# Altium schematic sheet perifericos.SchDoc: Periféricos do Controlador
size A4; Author: Matheus Gois Vieira; Address1: UnB; Address2: Faculdade do Gama
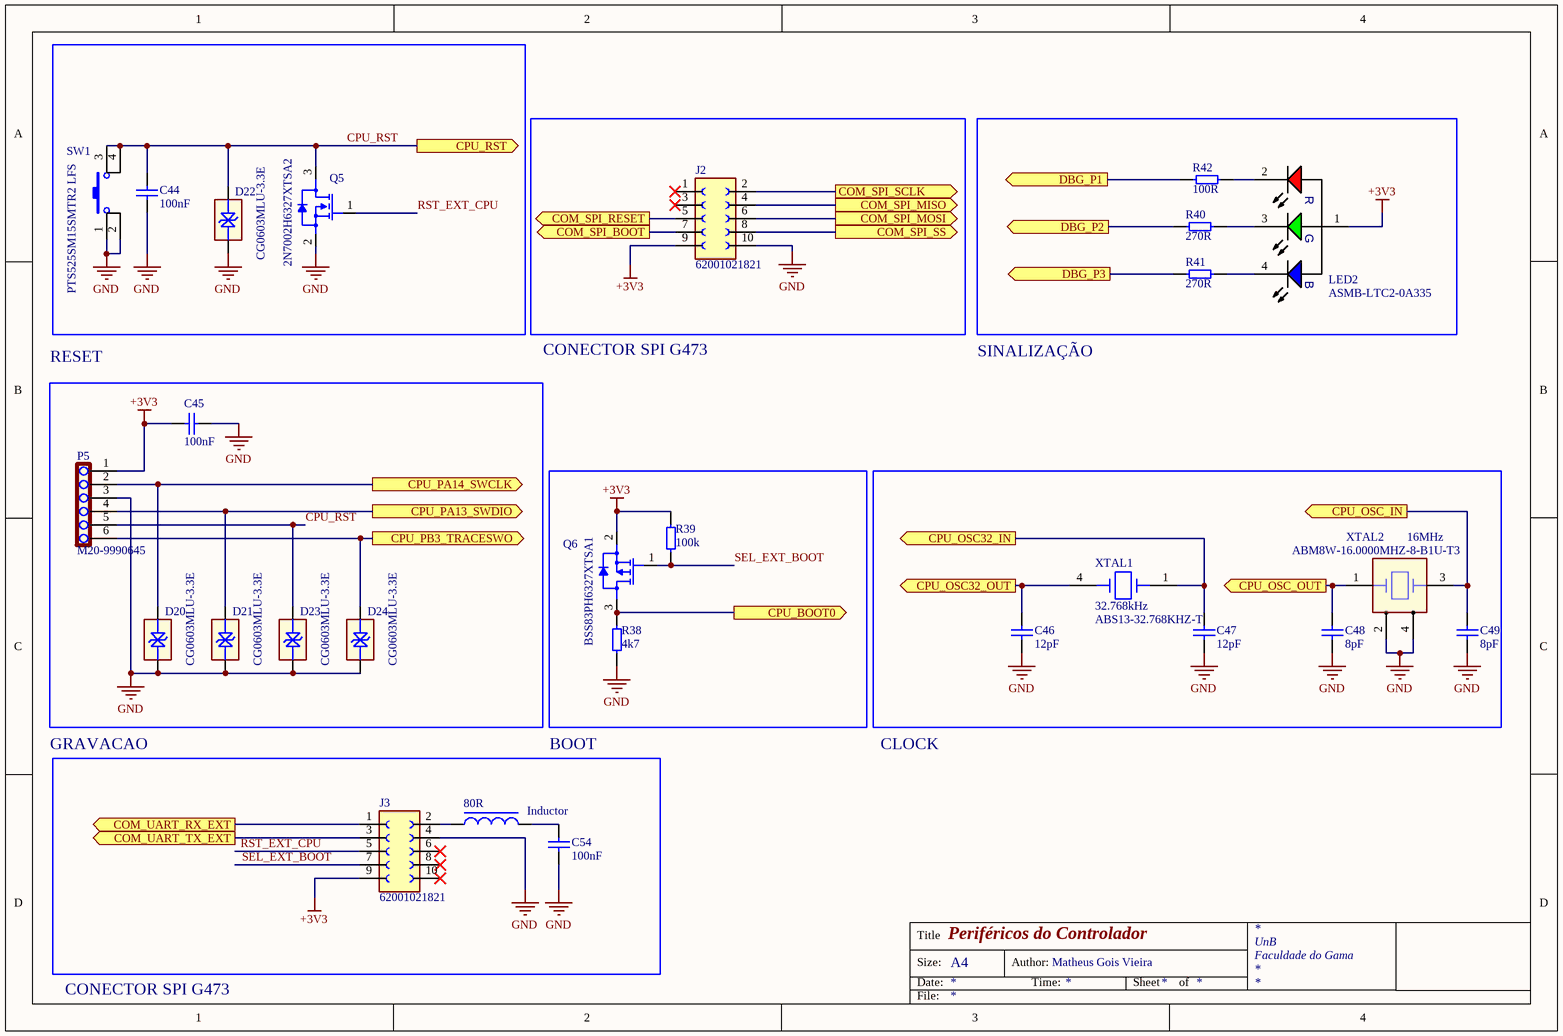
[diagram p0: perifericos.SchDoc]

## Parts
80R  Inductor  [R1608[0603]]
C44  100nF  [0603]
C45  100nF  [0603]
C46  12pF  [0603]
C47  12pF  [0603]
C48  8pF  [0603]
C49  8pF  [0603]
C54  100nF  [0603]
D20  CG0603MLU-3.3E  [DIODE-0603]
D21  CG0603MLU-3.3E  [DIODE-0603]
D22  CG0603MLU-3.3E  [DIODE-0603]
D23  CG0603MLU-3.3E  [DIODE-0603]
D24  CG0603MLU-3.3E  [DIODE-0603]
J2  62001021821  [62001021821]
J3  62001021821  [62001021821]
LED2  ASMB-LTC2-0A335  [ASMB-LTC2-0A335]
P5  M20-9990645  [HDR1X6-2.54MM]
Q5  2N7002H6327XTSA2  [CI-SOT-23]
Q6  BSS83PH6327XTSA1  [CI-SOT-23]
R38  4k7  [0603]
R39  100k  [0603]
R40  270R  [0603]
R41  270R  [0603]
R42  100R  [0603]
SW1  value PTS525SM15SMTR2 LFS  [SWTCH]  (hidden comment: Tact Switch)
XTAL1  32.768kHz  MPN: ABS13-32.768KHZ-T  [XTAL4P_ABS13]
XTAL2  16MHz  MPN: ABM8W-16.0000MHZ-8-B1U-T3  [XTAL4P]

## Blocks framed on the sheet
RESET: C45 D20 D21 D23 D24 P5

## Ports
COM_SPI_BOOT (out), COM_SPI_MISO (out), COM_SPI_MOSI (out), COM_SPI_RESET (out), COM_SPI_SCLK (out), COM_SPI_SS (out), COM_UART_RX_EXT (out), COM_UART_TX_EXT (out), CPU_BOOT0 (out), CPU_OSC32_IN (out), CPU_OSC32_OUT (out), CPU_OSC_IN (out), CPU_OSC_OUT (out), CPU_PA13_SWDIO (out), CPU_PA14_SWCLK (out), CPU_PB3_TRACESWO (out), CPU_RST (out), DBG_P1 (out), DBG_P2 (out), DBG_P3 (out)

## Nets
+3V3: C45.1 J2.9 J3.9 LED2.1(A) P5.1 Q6.2(S) R39.2
GND: C44.2 C45.2 C46.1 C47.1 C48.1 C49.1 C54.2 D20.1 D21.1 D22.1 D23.1 D24.1 J2.10 J3.4 P5.3 Q5.2(S) R38.1 SW1.1 SW1.2 XTAL2.2(GND) XTAL2.4(GND)
COM_SPI_BOOT: J2.7 ; port COM_SPI_BOOT
COM_SPI_MISO: J2.4 ; port COM_SPI_MISO
COM_SPI_MOSI: J2.6 ; port COM_SPI_MOSI
COM_SPI_RESET: J2.5 ; port COM_SPI_RESET
COM_SPI_SCLK: J2.2 ; port COM_SPI_SCLK
COM_SPI_SS: J2.8 ; port COM_SPI_SS
COM_UART_RX_EXT: J3.1 ; port COM_UART_RX_EXT
COM_UART_TX_EXT: J3.3 ; port COM_UART_TX_EXT
CPU_BOOT0: Q6.3(D) R38.2 ; port CPU_BOOT0
CPU_OSC32_IN: C47.2 XTAL1.1 ; port CPU_OSC32_IN
CPU_OSC32_OUT: C46.2 XTAL1.4 ; port CPU_OSC32_OUT
CPU_OSC_IN: C49.2 XTAL2.3 ; port CPU_OSC_IN
CPU_OSC_OUT: C48.2 XTAL2.1 ; port CPU_OSC_OUT
CPU_PA13_SWDIO: D21.2 P5.4 ; port CPU_PA13_SWDIO
CPU_PA14_SWCLK: D20.2 P5.2 ; port CPU_PA14_SWCLK
CPU_PB3_TRACESWO: D24.2 P5.6 ; port CPU_PB3_TRACESWO
CPU_RST: C44.1 D22.2 D23.2 P5.5 Q5.3(D) SW1.3 SW1.4 ; port CPU_RST
DBG_P1: R42.1 ; port DBG_P1
DBG_P2: R40.1 ; port DBG_P2
DBG_P3: R41.1 ; port DBG_P3
RST_EXT_CPU: J3.5 Q5.1(G)
SEL_EXT_BOOT: J3.7 Q6.1(G) R39.1
Net80R_1: 80R.1 J3.2
Net80R_2: 80R.2 C54.1
NetLED2_2: LED2.2(R) R42.2
NetLED2_3: LED2.3(G) R40.2
NetLED2_4: LED2.4(B) R41.2

Not connected (* = marked no-connect by the designer): J2 1* 3(2)*; J3 6(8)* 8(7)* 10(6)*

## Notes on the sheet
- CONECTOR SPI G473
- SINALIZAÇÃO
- GRAVACAO
- BOOT
- CLOCK
- Title
- Size:
- Date:
- A4
- Author:
- Time:
- Sheet
- of
- File:

## Library data of the parts
80R = L: Manufacturer: *; PartNumber: *; Package Type: *; Value: *
C44 C45 C54 = CAP CER SMD-0603 100nF - 50V: Capacitor Ceramic 100nF 20% 50V 0603 (1608 Metric) X7R; MPN: C0603C104M5RACTU; Manufacturer: KEMET; CDI: 018177; Op_Temperature: -55 C to +125 C; Type: Capacitor Ceramic; Value: 100nF; Tolerance: 20%; Package: Tape & Reel; RoHS: SIM; Voltage: 50V; Case: 0603 (1608 Metric); Temp_Coefficient: X7R; NCM: *; CDI_Alternate: *; MPN_Alternate: *; Manufacturer_Alternate: *; Price (und.): 0,10000; Price (10k): 0.00741
C46 C47 = CAP CER SMD-0603 12pF - 50V: Capacitor Ceramic 12pF 10% 50V 0603 (1608 Metric) C0G (NP0); MPN: 06035A120KAT2A; Manufacturer: AVX; CDI: 020618; Op_Temperature: -55 C to +125 C; Type: Capacitor Ceramic; Value: 12pF; Voltage: 50V; Tolerance: 10%; Package: Tape & Reel; Case: 0603 (1608 Metric); Temp_Coefficient: C0G (NP0); RoHS: SIM; NCM: *; CDI_Alternate: *; MPN_Alternate: *; Manufacturer_Alternate: *; Price (und.): 0.22; Price (10k): 0.039
C48 C49 = CAP CER SMD-0603 8pF - 50V: Capacitor Ceramic 8pF 50V 0603 (1608 Metric) C0G (NP0); MPN: CC0603DRNPO9BN8R0; Manufacturer: Yageo; CDI: 020657; Tolerance: 0.5pF; Op_Temperature: -55 C to +125 C; Type: Capacitor Ceramic; Value: 8pF; Package: Tape & Reel; RoHS: SIM; Voltage: 50V; Case: 0603 (1608 Metric); Temp_Coefficient: C0G (NP0); NCM: *; CDI_Alternate: *; MPN_Alternate: *; Manufacturer_Alternate: *; Price (und.): 0,10000; Price (10k): 0.01346
D20-D24 = DIODE SMD CG0603MLU-3.3E: TVS DIODE 3.3V 25V 0603 (1608 metric); Manufacturer: Bourns; Type: Diode TVS; Op_Temperature: -40 C to +125 C; CDI: 014983; Value: CG0603MLU-3.3E; Package: Tape & Reel; MPN: CG0603MLU-3.3E; RoHS: SIM; Price (und.): 0,44; Voltage: 3.3V; Case: 0603 (1608 metric); Price (10k): 0.112
J2 J3 = 62001021821: Female header Temperature range: -40 ... +125 Â°C Colour: Black Connector Design: Double Row / Straight Connector Termination: THT Contact material: Gold-Plated Copper Gender of contacts: Female Housing Material: Polybutylene Terephthalate (PBT) Pitch: 2 mm Series: WR-PHD Poles: 10 Rated current: 2 A Rated voltage: 250 VAC; MF: WÃ¼rth Elektronik; SnapEDA_Link: https://www.snapeda.com/parts/62001021821/Wurth+Elektronik/view-part/?ref=snap; Availability: In Stock; Package: None; Check_prices: https://www.snapeda.com/parts/62001021821/Wurth+Elektronik/view-part/?ref=eda; Price: None; MP: 62001021821; Purchase-URL: https://pricing.snapeda.com/search/part/62001021821/?ref=eda; Value: *
LED2 = LED2 SMD-2121 PLCC4 RGB AComum: LED SMD-2121 PLCC4 RGB - 70mcd Red (2V), 300mcd Green (2.7V), 50mcd Blue (2.7V); Manufacturer: Broadcom Limited; Type: LED SMD; Millicandela_Rating: 70mcd Red, 300mcd Green, 50mcd Blue; Voltage_Forward_Vf_Typ: Red (2V), Green (2.7V), Blue (2.7V); Wavelength_Dominant: 621nm Red, 525nm Green, 468nm Blue; Current_Test: 5mA; Complement_Value: Angle 105°; PCB_INFO: Assembly; Extra_Info: -40 C to +85 C; Engineering_Change_Status_Code: Pending; Revisao: A; CDI: 020457; Component Type: Standard; Value: ASMB-LTC2-0A335; Color: RGB; Package: PLCC4; Size_Dimension: 2.10mm L x 2.10mm W; MPN: ASMB-LTC2-0A335; Model_File: LED; RoHS: SIM; Case: 4-SMD, J-Lead; Price (10k): 0.16500; Price (und.): 0,58000
P5 = HEADER 1x6 PTH: Header, 6-Pin, 2.54mm, PCB; Manufacturer: HARWIN; Op_Temperature: -40°C ~ 105°C; CDI: 020492; Type: Header; Value: M20-9990645; Package: Bulk; MPN: M20-9990645; RoHS: SIM; Price (10k): 0.11029; Price (und.): 0.29000; Case: PTH 1mm 2X2 2.54MM
Q5 = MOSFET N-CHANNEL 2N7002: MOSFET N-CH 60V 300mA SOT23-3; Manufacturer: Infineon; Op_Temperature: -55°C ~ 150°C; CDI: 020458; Type: MOSFET; Value: 2N7002H6327XTSA2; Current_Id: 300mA; Package: Tape & Reel; MPN: 2N7002H6327XTSA2; RoHS: SIM; Case: SOT-23-3; Current: 300mA; Price (10k): 0.04370; Price (und.): 0,29000
Q6 = MOSFET P-CHANNEL BSS83P: MOSFET P-CH 60V 330mA SOT23-3; Manufacturer: Infineon; Op_Temperature: -55°C ~ 150°C; CDI: 020459; Type: MOSFET; Value: BSS83PH6327XTSA1; Current_Id: 330mA; Package: Tape & Reel; MPN: BSS83PH6327XTSA1; RoHS: SIM; Case: SOT-23-3; Current: 330mA; Price (10k): 0.10362; Price (und.): 0,49000
R38 = RES SMD-0603 4k7 0.5% 1/16W: Resistor Thick Film 4k7 0.5% 0.063W, 1/16W 0603 (1608 metric) +/- 25 PPM / K; MPN: RR0816P-472-D; Manufacturer: Susumu; CDI: 019051; Op_Temperature: -55 C to +125 C; Type: Resistor Thick Film; Value: 4k7; Package: Tape & Reel; RoHS: SIM; Tolerance: 0.5%; Power (Watts): 1/16W; Case: 0603; Price (10k): 0.00993; Price (und.): 0,10000
R39 = RES SMD-0603 100k 1% 1/10W: Resistor Thick Film 100k 1% 0.1W, 1/10W 0603 (1608 metric) +/- 100 PPM / K; MPN: CRCW0603100KFKEA; Manufacturer: Vishay; MPN_Alternate: ERJ-3EKF1003V; CDI: 017438; Op_Temperature: -55 C to +155 C; Type: Resistor Thick Film; Value: 100k; Tolerance: 1%; Package: Tape & Reel; RoHS: SIM; Power (Watts): 1/10W; Case: 0603; Price (10k): 0.00468; Price (und.): 0,10000
R40 R41 = RES SMD-0603 270R 1% 1/10W: Resistor Thick Film 270 Ohms ±1% 0.1W, 1/10W Chip Resistor 0603 (1608 Metric) Automotive AEC-Q200 Thick Film; MPN: RMCF0603FT270R; Manufacturer: Stackpole Electronics Inc; CDI: 013719; Op_Temperature: -55 C to +155 C; Type: Resistor Thick Film; Value: 270R; Tolerance: ±1%; Package: Tape & Reel; RoHS: SIM; Power (Watts): 1/10W; Voltage: *; Case: 0603; NCM: *; CDI_Alternate: *; MPN_Alternate: *; Manufacturer_Alternate: *; Price (und.): 0,10000; Price (10k): 0.00218
R42 = RES SMD-0603 100R 1% 1/10W: Resistor Thick Film 100R 1% 0.1W, 1/10W 0603 (1608 metric) +/- 100 PPM / K; MPN: RC0603FR-07100RL; Manufacturer: Yageo; CDI: 020463; Op_Temperature: -55 C to +155 C; Type: Resistor Thick Film; Value: 100R; Tolerance: 1%; Package: Tape & Reel; RoHS: SIM; Power (Watts): 1/10W; Case: 0603; Price (10k): 0.002; Price (und.): 0.10
SW1 = Tact Switch: Chave pushbuttom NA polo simples SMD; Manufacturer: C&K; CDI: 014225; Op_Temperature: -20°C ~ 70°C; MPN: PTS525SM15SMTR2 LFS; Case: 5.25x5.25mm; Package: Tape & Reel; Price (10k): 0.16066; Price (und.): 0,29000; RoHS: SIM; Type: Switches
XTAL1 = XTAL-ABS13-32.768kHz: Crystal 32.768kHz 20PPM SMD; Manufacturer: Abracon; Clamper_PN: XTAL0010; Op_Temperature: -40°C ~ 85°C; CDI: 020477; Case: 2-SMD; Value: 32.768kHz; Tolerance: 20PPM; Package: Tape & Reel; Price (10k): 0.45; Price (und.): 0.79; RoHS: SIM; Type: Crystals
XTAL2 = XTAL-ABM8W-16MHz: Crystal 16MHz 10PPM SMD; Manufacturer: Abracon; Clamper_PN: XTAL0010; Op_Temperature: -20°C ~ 70°C; CDI: 020479; Case: 4-SMD; Value: 16MHz; Tolerance: 10PPM; Package: Tape & Reel; Price (10k): 0.33408; Price (und.): 0,69000; RoHS: SIM; Type: Crystals